# EAGLE design single_button-dual_LED (EAGLE 7.3.0)
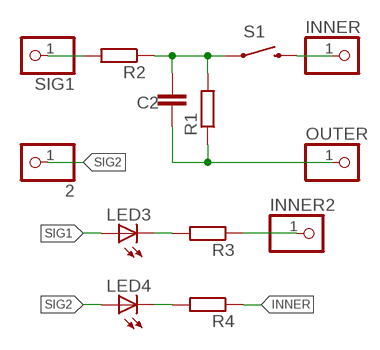
[diagram p0: schematic, sheet 1]

## Parts
2  PINHD-1X1CB  [1X01-CLEANBIG]
C2  CAPACITOR_NPOL-0805  [C805]
INNER  PINHD-1X1CB  [1X01-CLEANBIG]
INNER2  PINHD-1X1CB  [1X01-CLEANBIG]
LED3  LED-0805  [LED-805]
LED4  LED-0805  [LED-805]
OUTER  PINHD-1X1CB  [1X01-CLEANBIG]
R1  RESISTORR805-0805  [R805]
R2  RESISTORR805-0805  [R805]
R3  RESISTORR805-0805  [R805]
R4  RESISTORR805-0805  [R805]
S1  SWITCH-MOMENTARY-2PTH  [TACTILE-PTH]
SIG1  PINHD-1X1CB  [1X01-CLEANBIG]

## Nets
INNER: INNER.1 R4.1 S1.3 S1.4
N$1: C2.1 R1.2 R2.1 S1.1 S1.2
N$2: LED4.C R4.2
N$3: LED3.C R3.2
N$4: INNER2.1 R3.1
OUTER: C2.2 OUTER.1 R1.1
SIG1: LED3.A R2.2 SIG1.1
SIG2: 2.1 LED4.A

## Library data of the parts
2 INNER INNER2 OUTER SIG1 = adafruit:PINHD-1X1: Pin header 1x1 for 0.1" spacing With round pins
C2 = dp_devices:CAPACITOR_NPOL: Non-Polarized capacitor in various packages
LED3 LED4 = dp_devices:LED: Light Emitting Diode
R1-R4 = dp_devices:RESISTOR
S1 = SparkFun-Electromechanical:SWITCH-MOMENTARY-2: Various NO switches- pushbuttons, reed, etc

## Board
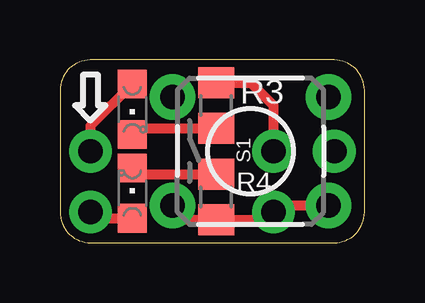
[diagram p1: board, top side]
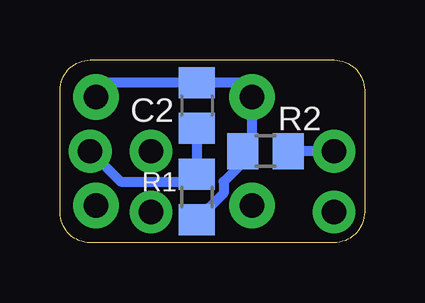
[diagram p2: board, bottom side, seen from below]

Size 12.69 x 7.61 mm. Coordinates in mm from the lower left corner, seen from the top.
Outline: 0,6.35 0,1.27 arc90 1.27,0 11.43,0 arc90 12.69,1.26 12.69,6.35 arc90 11.43,7.61 1.26,7.61 arc90 0,6.35
Copper layers (1*16): Top 0.035mm / dielectric 1.5mm / Bottom 0.035mm
Design rules "dirt_cheap_dirty_boards.v1": minimum track width 5mil, minimum drill 12mil, track to track 5mil, track to pad 5mil, pad to pad 5mil, via to via 5mil, smd to smd 0mil, copper to edge 10mil, drill to drill 10mil, minimum pad ring 10mil, minimum via ring 6mil, stop-mask expansion 2mil, vias tented up to drill 25mil, thermal gap 10mil

### Footprints (pad centres in the part's own frame; a part is rotated, then mirrored left to right if it is on the bottom)
1X01-CLEANBIG = drill 1.016 pad 1.778: 1 0,0
C805 = smd 1.3 x 1.5: 1 -0.95,0; 2 0.95,0
LED-805 = smd 1.2 x 1.2: A 0,-1.05; C 0,1.05
R805 = smd 1.3 x 1.5: 1 -0.95,0; 2 0.95,0
TACTILE-PTH = drill 1.016 pad 1.88: 1 -3.251,2.261; 2 3.251,2.261; 3 -3.251,-2.261; 4 3.251,-2.261

### Placement (x,y rotation side)
2  1.27,1.27 0 top
C2  6.99,5.71 270 bottom
INNER  8.89,1.27 0 top
INNER2  8.89,3.81 0 top
LED3  3.02,5.56 180 top
LED4  3.02,2.06 0 top
OUTER  11.43,3.81 0 top
R1  6.99,1.91 270 bottom
R2  4.13,3.81 0 bottom
R3  6.51,5.71 270 top
R4  6.51,1.91 90 top
S1  7.94,3.81 0 top
SIG1  1.27,3.81 0 top

### Tracks (layer width: path | path; a pad name or v marks a point on that pad's centre or on a via)
INNER
  Top 0.406: S1.3 5.28,0.95 R4.1 8.57,0.95 INNER.1 9.17,1.55 S1.4
N$1
  Bottom 0.406: S1.2 10.59,6.67 C2.1 5.28,6.67 S1.1 4.69,4.2 R2.1 5.08,3.34 5.87,2.54 5.87,2.07 R1.2
N$2
  Top 0.406: LED4.C 3.27,2.85 R4.2
N$3
  Top 0.406: LED3.C 3.27,4.76 R3.2
N$4
  Top 0.406: R3.1 7.94,6.67 8.89,5.71 INNER2.1
OUTER
  Bottom 0.406: C2.2 R1.1 7.3,2.54 10.16,2.54 OUTER.1
SIG1
  Top 0.406: LED3.A 1.27,4.86 SIG1.1
  Bottom 0.406: SIG1.1 R2.2
SIG2
  Top 0.406: 2.1 1.53,1.01 LED4.A